# Altium schematic sheet Filter Capacitors - IoT UART.SchDoc: IoT UART Filter Capacitors
size A4; DocumentNumber: 39; SheetNumber: 39; SheetTotal: 54
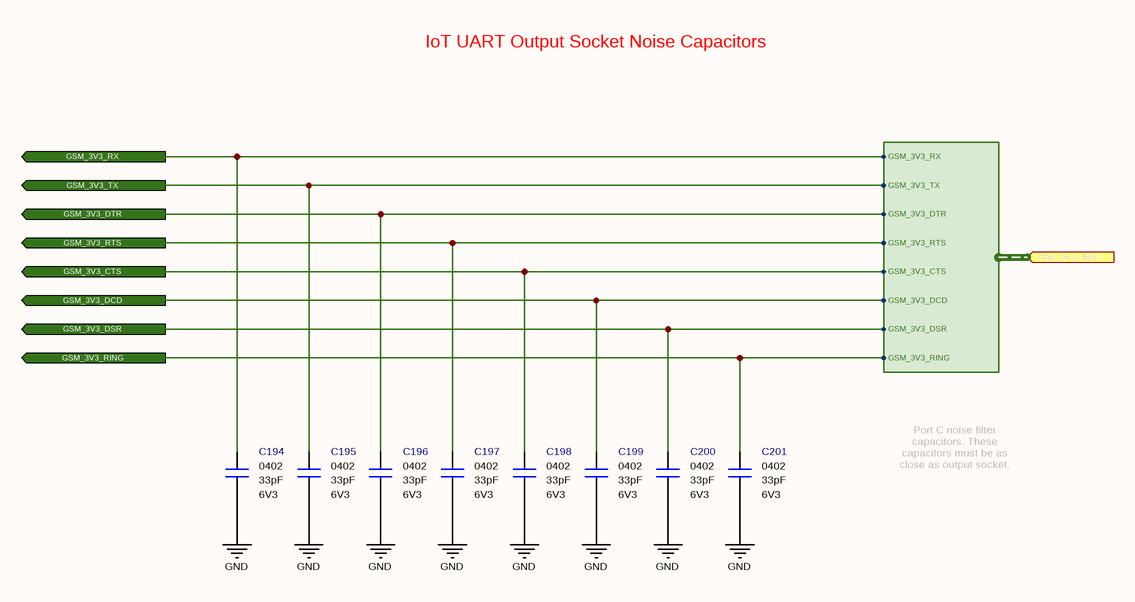
[diagram p0: Filter Capacitors - IoT UART.SchDoc]

## Parts
C194  value 33pF  Case: 0402  Voltage: 6V3  [CAPACITOR_0402]  (hidden comment: Multilayer Ceramic Capacitor)
C195  value 33pF  Case: 0402  Voltage: 6V3  [CAPACITOR_0402]  (hidden comment: Multilayer Ceramic Capacitor)
C196  value 33pF  Case: 0402  Voltage: 6V3  [CAPACITOR_0402]  (hidden comment: Multilayer Ceramic Capacitor)
C197  value 33pF  Case: 0402  Voltage: 6V3  [CAPACITOR_0402]  (hidden comment: Multilayer Ceramic Capacitor)
C198  value 33pF  Case: 0402  Voltage: 6V3  [CAPACITOR_0402]  (hidden comment: Multilayer Ceramic Capacitor)
C199  value 33pF  Case: 0402  Voltage: 6V3  [CAPACITOR_0402]  (hidden comment: Multilayer Ceramic Capacitor)
C200  value 33pF  Case: 0402  Voltage: 6V3  [CAPACITOR_0402]  (hidden comment: Multilayer Ceramic Capacitor)
C201  value 33pF  Case: 0402  Voltage: 6V3  [CAPACITOR_0402]  (hidden comment: Multilayer Ceramic Capacitor)

## Ports
GSM_3V3_CTS (out), GSM_3V3_DCD (out), GSM_3V3_DSR (out), GSM_3V3_DTR (out), GSM_3V3_RING (out), GSM_3V3_RTS (out), GSM_3V3_RX (out), GSM_3V3_TX (out), GSM_3V3_UART (in, harness GSM_3V3_UART)

## Harnesses
GSM_3V3_UART: GSM_3V3_RX, GSM_3V3_TX, GSM_3V3_DTR, GSM_3V3_RTS, GSM_3V3_CTS, GSM_3V3_DCD, GSM_3V3_DSR, GSM_3V3_RING

## Nets
GND: C194.1 C195.1 C196.1 C197.1 C198.1 C199.1 C200.1 C201.1
GSM_3V3_CTS: C198.2 ; port GSM_3V3_CTS, port GSM_3V3_UART.GSM_3V3_CTS
GSM_3V3_DCD: C199.2 ; port GSM_3V3_DCD, port GSM_3V3_UART.GSM_3V3_DCD
GSM_3V3_DSR: C200.2 ; port GSM_3V3_DSR, port GSM_3V3_UART.GSM_3V3_DSR
GSM_3V3_DTR: C196.2 ; port GSM_3V3_DTR, port GSM_3V3_UART.GSM_3V3_DTR
GSM_3V3_RING: C201.2 ; port GSM_3V3_RING, port GSM_3V3_UART.GSM_3V3_RING
GSM_3V3_RTS: C197.2 ; port GSM_3V3_RTS, port GSM_3V3_UART.GSM_3V3_RTS
GSM_3V3_RX: C194.2 ; port GSM_3V3_RX, port GSM_3V3_UART.GSM_3V3_RX
GSM_3V3_TX: C195.2 ; port GSM_3V3_TX, port GSM_3V3_UART.GSM_3V3_TX

## Notes on the sheet
- IoT UART Output Socket Noise Capacitors
- Port C noise filter capacitors. These capacitors must be as close as output socket.
- Engineer
- All Rights are reserved to Customer and Engineer. [2021]
- Size:
- Date:
- A4
- Project :
- Time:
- Sheet
- of
- Customer
- Product ID
- Module ID
- Version
- File:
- Revision

## Library data of the parts
C194-C201 = Capacitor - 33pF [0402-6V3]: Capacitor - 33pF [0402] (Ceramic); Manufacturer Name: Kemet; Manufacturer Part Number: C0402C330J9RACAUTO; Dielectric: X7R; Tolerance: 10%; Height: 0.5mm; Maximum Operating Temperature: +125; Minimum Operating Temperature: -55; ROHS: Yes; ComponentLink1Description: DataSheet; ComponentLink1URL: https://api.kemet.com/component-edge/download/datasheet/C0402C330J9RACAUTO.pdf; ComponentLink2Description: Mouser; ComponentLink2URL: https://www.mouser.com/Search/Refine.aspx?Keyword=80-C0402C330J9RAUTO; Supplier 1: Mouser; Supplier Part Number 1: 80-C0402C330J9RAUTO; Mouser Part Number: 80-C0402C330J9RAUTO